# Altium schematic sheet Radio.SchDoc: Plant - Radio
size A4; Author: Carlos de la Fuente; DrawnBy: Carlos de la Fuente; DocumentNumber: Radio; Revision: 0.2; SheetNumber: 2; SheetTotal: 5
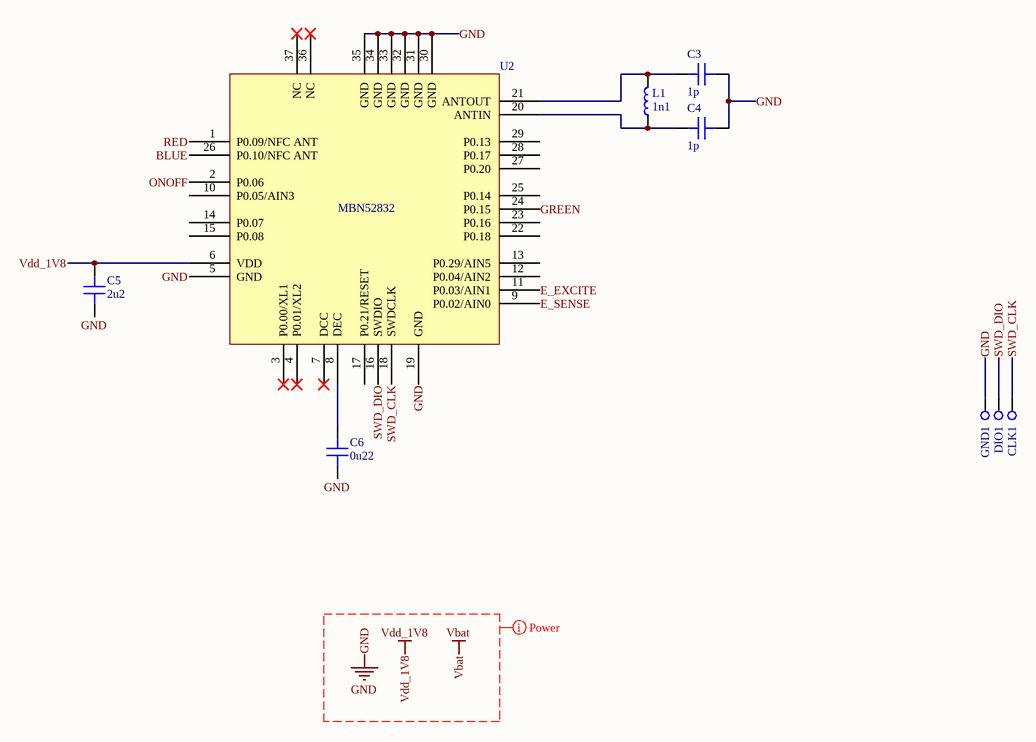
[diagram p0: Radio.SchDoc]

## Parts
C3  1p  [CAP 0201/0603]
C4  1p  [CAP 0201/0603]
C5  2u2  [CAP 0402/1005]
C6  0u22  [CAP 0201/0603]
CLK1  Test Point  [TP SMD 1MM]  (value not drawn)  (no BOM)
DIO1  Test Point  [TP SMD 1MM]  (value not drawn)  (no BOM)
GND1  Test Point  [TP SMD 1MM]  (value not drawn)  (no BOM)
L1  1n1  [FER 0402/1005]
U2  MBN52832  [Murata MBN52832]

## Nets
GND: C3.2 C4.2 C5.1 C6.1 GND1.1(TP) U2.5(GND) U2.19(GND) U2.30(GND) U2.31(GND) U2.32(GND) U2.33(GND) U2.34(GND) U2.35(GND)
Vdd_1V8: C5.2 U2.6(VDD)
BLUE: U2.26(P0.10/NFC_ANT)
E_EXCITE: U2.11(P0.03/AIN1)
E_SENSE: U2.9(P0.02/AIN0)
GREEN: U2.24(P0.15)
ONOFF: U2.2(P0.06)
RED: U2.1(P0.09/NFC_ANT)
SWD_CLK: CLK1.1(TP) U2.18(SWDCLK)
SWD_DIO: DIO1.1(TP) U2.16(SWDIO)
NetC3_1: C3.1 L1.2 U2.21(ANTOUT)
NetC4_1: C4.1 L1.1 U2.20(ANTIN)
NetC6_2: C6.2 U2.8(DEC)

Not connected (* = marked no-connect by the designer): U2 3(P0.00/XL1)* 4(P0.01/XL2)* 7(DCC)* 10(P0.05/AIN3) 12(P0.04/AIN2) 13(P0.29/AIN5) 14(P0.07) 15(P0.08) 17(P0.21/RESET) 22(P0.18) 23(P0.16) 25(P0.14) 27(P0.20) 28(P0.17) 29(P0.13) 36(NC)* 37(NC)*

## Layout directives
net class Power: GND, Vbat, Vdd_1V8

## Notes on the sheet
- Title
- Size:
- Date:
- A4
- Project:
- Time:
- Sheet
- Drawn By:
- Revision:
- of
- File:

## Library data of the parts
C3 C4 = GRM0335C1H1R0BA01D: CAP CER 0201 1pF 50V ±0.1pF C0G; Manufacturer: Murata; Value: 1p; Part Number: GRM0335C1H1R0BA01D; Creation Date: 02/07/2019; Revision Date: 02/07/2019; Supplier 1: Digi-Key; Supplier Part Number 1: 490-9660-1-ND; Manufacturer Part Number: GRM0335C1H1R0BA01D; Stock 1: 521200; Pricing 1: 1=0,10000, 10=0,02000, 100=0,00900, 500=0,00644, 1000=0,00506, 2500=0,00460, 5000=0,00423 (USD); RoHS: Yes; Mount: Surface Mount; Case/Package: 0201; Min Operating Temperature: -55°C; Max Operating Temperature: 125°C; Packaging: Tape and Reel; Voltage Rating (DC): 50V; Length: 0.024inch; Width: 0.012inch; Depth: 0.3mm; ComponentLink1URL: https://datasheet.ciiva.com/29538/partnumbering-e-01-29538566.pdf?src-supplier=Digi-Key; ComponentLink1Description: https://datasheet.ciiva.com/29538/partnumbering-e-01-29538566.pdf?src-supplier=Digi-Key; Case Code (Imperial): 0201; Case Code (Metric): 0603; Voltage Rating: 50V; Package Quantity: 15000; Termination: SMD/SMT; Capacitance: 1pF; Dielectric: C0G; Thickness: 0.013inch
C5 = GRM155R61C225KE11D: CAP CER 0402 2.2uF 16V 10% X5R; Manufacturer: Murata; Note: recommended; Material: Ceramic; Value: 2u2; Part Number: GRM155R61C225KE11D; Supplier 1: Digi-Key; Supplier Part Number 1: 490-10695-1-ND; Manufacturer Part Number: GRM155R61C225KE11D; Stock 1: 2251620; Pricing 1: 1=0,23000, 10=0,15900, 100=0,08990, 500=0,06348, 1000=0,05555, 2500=0,05290, 5000=0,04893 (USD); RoHS: Yes; Mount: Surface Mount; Case/Package: 0402; Min Operating Temperature: -55°C; Max Operating Temperature: 85°C; Tolerance: 10%; Packaging: Tape and Reel; Voltage Rating (DC): 16V; Length: 0.039inch; Height: 0.3mm; Width: 0.02inch; ComponentLink1URL: http://components.arrow.com/part/dataview/0323_07281440?src-supplier=Arrow+Europe; ComponentLink1Description: http://components.arrow.com/part/dataview/0323_07281440?src-supplier=Arrow+Europe; Case Code (Imperial): 0402; Case Code (Metric): 1005; Voltage Rating: 16V; Capacitance: 2.2uF; Thickness: 0.022inch; ComponentLink2URL: http://www.mouser.com/ds/2/281/c02e-2905.pdf?src-s; ComponentLink2Description: http://www.mouser.com/ds/2/281/c02e-2905.pdf?src-s; ComponentLink3URL: https://search.murata.co.jp/Ceramy/image/img/A01X/; ComponentLink3Description: https://search.murata.co.jp/Ceramy/image/img/A01X/; Creation Date: 10/10/2019; Revision Date: 10/10/2019
C6 = GRM033R61A224KE90D: CAP CER 0201 0.22uF 10V 10% X5R; Manufacturer: Murata; Note: recommended; Capacitance: 220nF; Value: 0u22; Part Number: GRM033R61A224KE90D; Creation Date: 19/01/2021; Revision Date: 19/01/2021; Supplier 1: Digi-Key; Supplier Part Number 1: 490-10411-1-ND; Manufacturer Part Number: GRM033R61A224KE90D; Stock 1: 951885; Pricing 1: 1=0,10000, 10=0,03600, 50=0,01980, 100=0,01620, 500=0,01156, 1000=0,00908, 2500=0,00825, 5000=0,00759 (USD); RoHS: Yes; Mount: Surface Mount; Case/Package: 0201; Min Operating Temperature: -55°C; Max Operating Temperature: 85°C; Tolerance: 10%; Packaging: Tape and Reel; Voltage Rating (DC): 10V; Length: 0.024inch; Height: 0.5mm; Width: 0.012inch; Lead Free: Lead Free; ComponentLink1URL: http://www.farnell.com/datasheets/2867835.pdf?src-supplier=Farnell; ComponentLink1Description: http://www.farnell.com/datasheets/2867835.pdf?src-supplier=Farnell; Case Code (Imperial): 0201; Case Code (Metric): 0603; Voltage Rating: 10V; Dielectric: X5R; Thickness: 0.013inch; ComponentLink2URL: http://www.mouser.com/ds/2/281/c02e-2905.pdf?src-s; ComponentLink2Description: http://www.mouser.com/ds/2/281/c02e-2905.pdf?src-s; ComponentLink3URL: http://search.murata.co.jp/Ceramy/image/img/A01X/G; ComponentLink3Description: http://search.murata.co.jp/Ceramy/image/img/A01X/G; ComponentLink4URL: http://www.farnell.com/datasheets/2867835.pdf?src-; ComponentLink4Description: http://www.farnell.com/datasheets/2867835.pdf?src-; ComponentLink5URL: http://www.mouser.com/ds/2/281/c02e-2905.pdf?src-s; ComponentLink5Description: http://www.mouser.com/ds/2/281/c02e-2905.pdf?src-s; ComponentLink6URL: http://search.murata.co.jp/Ceramy/image/img/A01X/G; ComponentLink6Description: http://search.murata.co.jp/Ceramy/image/img/A01X/G; ComponentLink7URL: http://search.murata.co.jp/Ceramy/image/img/A01X/p; ComponentLink7Description: http://search.murata.co.jp/Ceramy/image/img/A01X/p; Manufacturer 1: Murata; Manufacturer Part Number 1: GRM033R61A224KE90D; RoHS Compliant: Yes; Resistor Type: Ceramic
CLK1 DIO1 GND1 = TPSMD1: TP 1mm round pad; Part Number: TPSMD1; Value: TP; Revision Date: 03/07/2019; Creation Date: 08/05/2019
L1 = LQP03TN1N1B02D_mod: IND 0201 1.1nH +-0.1nH 0.75A 0.1R; Manufacturer: Murata; Core Material: Non-Magnetic; Self Resonant Frequency: 17GHz; Shielding: Unshielded; DC Resistance (DCR): 100mR; Q Factor: 14; Current Rating: 750mA; Test Frequency: 500MHz; Value: 1n1; Part Number: LQP03TN1N1B02D_mod; Creation Date: 10/10/2019; Revision Date: 10/10/2019; Supplier 1: Digi-Key; Supplier Part Number 1: 490-6715-1-ND; Manufacturer Part Number: LQP03TN1N1B02D; Stock 1: 87622; Pricing 1: 1=0,10000, 10=0,04700, 100=0,03110, 500=0,02588, 1000=0,02174, 2500=0,01863 (USD); RoHS: Yes; Mount: Surface Mount; Case/Package: 0201; Min Operating Temperature: -55°C; Max Operating Temperature: 125°C; Packaging: Tape and Reel; Case Code (Imperial): 0201; Case Code (Metric): 0603; Package Quantity: 15000; Termination: SMD/SMT; Composition: Thin Film; Inductance: 1.1nH; Max DC Current: 750mA
U2 = WSM-BL241-ADA-008: Bluetooth v5.0 (BLE) SMART SOC IoT/NFC 1Mbps 3.3V; Manufacturer: Murata; Frequency: 2.4GHz; Interface: I2C,SPI,UART; Sensitivity: -93dBm; Current - Receiving: 6mA; Current - Transmitting: 7mA; Memory Size: 64KB; Part Number: WSM-BL241-ADA-008; Revision Date: 10/10/2019; Creation Date: 10/10/2019; Supplier 1: Mouser; Supplier Part Number 1: 81-WSM-BL241-ADA-008; Manufacturer Part Number: WSM-BL241-ADA-008; Stock 1: 4518; Pricing 1: 1=10,84000, 10=9,78000, 25=8,93000, 50=8,93000, 10; RoHS: No; Case/Package: Module; Min Operating Temperature: -40°C; Max Operating Temperature: 85°C; Packaging: Cut Tape; Data Rate: 1Mbps; ComponentLink1URL: http://www.farnell.com/datasheets/2575837.pdf?src-; ComponentLink1Description: http://www.farnell.com/datasheets/2575837.pdf?src-; ComponentLink2URL: https://wireless.murata.com/RFM/data/mbn52832_prod; ComponentLink2Description: https://wireless.murata.com/RFM/data/mbn52832_prod; ComponentLink3URL: http://www.farnell.com/datasheets/2575837.pdf?src-; ComponentLink3Description: http://www.farnell.com/datasheets/2575837.pdf?src-; Mount: Surface Mount